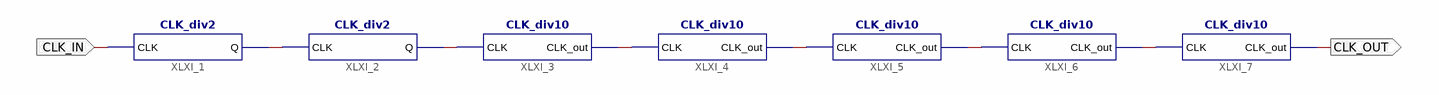
[diagram p0: schematic sheet 1]
// Xilinx ISE schematic Div_to50.sch (spartan6) as structural Verilog: 7 symbols, 2 ports
module Div_to50 (
  input  CLK_IN,
  output CLK_OUT
);

  wire XLXN_1, XLXN_2, XLXN_3, XLXN_4, XLXN_5, XLXN_6;

  CLK_div2 XLXI_1 (.CLK(CLK_IN), .Q(XLXN_1));
  CLK_div2 XLXI_2 (.CLK(XLXN_1), .Q(XLXN_2));
  CLK_div10 XLXI_3 (.CLK(XLXN_2), .CLK_out(XLXN_3));
  CLK_div10 XLXI_4 (.CLK(XLXN_3), .CLK_out(XLXN_4));
  CLK_div10 XLXI_5 (.CLK(XLXN_4), .CLK_out(XLXN_5));
  CLK_div10 XLXI_6 (.CLK(XLXN_5), .CLK_out(XLXN_6));
  CLK_div10 XLXI_7 (.CLK(XLXN_6), .CLK_out(CLK_OUT));
endmodule
